# Altium schematic sheet LedsYOtros.SchDoc
size A4; DocumentNumber: 6; SheetNumber: 6; SheetTotal: 6
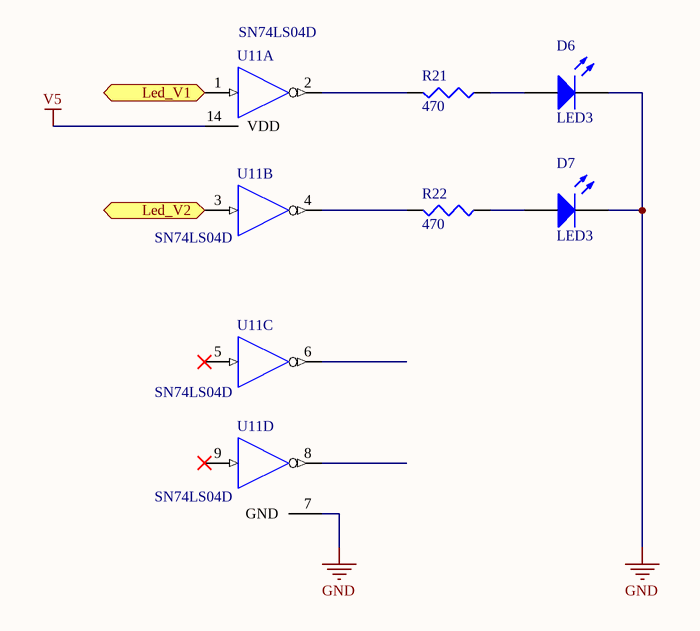
[diagram p0: LedsYOtros.SchDoc]

## Parts
D6  LED3  [*0603]
D7  LED3  [*0603]
R21  value 470  [Custom0805]  (hidden comment: Res3)
R22  value 470  [Custom0805]  (hidden comment: Res3)
U11  SN74LS04D  [751A-03_N]  (parts A,B,C,D of 6)

## Ports
Led_V1 (in), Led_V2 (in)

## Nets
GND: D6.2(K) D7.2(K) U11.7(GND)
V5: U11.14(VDD)
Led_V1: U11.1(IN) ; port Led_V1
Led_V2: U11.3(IN) ; port Led_V2
NetD6_1: D6.1(A) R21.1
NetD7_1: D7.1(A) R22.1
NetR21_2: R21.2 U11.2(~{OUT})
NetR22_2: R22.2 U11.4(~{OUT})

Not connected (* = marked no-connect by the designer): U11 5(IN)* 6(~{OUT}) 8(~{OUT}) 9(IN)*

## Library data of the parts
D6 D7 = LED3: Typical BLUE SiC LED; Published: 8-Jun-2000; LatestRevisionDate: 17-Dec-2003; LatestRevisionNote: PCB Footprint replaced.; DatasheetVersion: 16-Apr-2002; PackageVersion: 16-Apr-2002; PackageReference: 3.5X2.8X1.9; Publisher: Altium Limited; PackageDescription: SM LED; 2 C-Bend Leads; Body 3.5 x 2.8 x 1.9 mm, inc leads (LxWxH typ)
R21 R22 = Res3: Resistor; Published: 8-Jun-2000; LatestRevisionDate: 29-May-2009; LatestRevisionNote: IPC-7351 Footprint Added.; PackageReference: J1-0603; Publisher: Altium Limited; PackageDescription: Chip Resistor
U11 = SN74LS04D: Hex Inverter; Published: 15-Apr-2002; LatestRevisionDate: 13-Apr-2006; LatestRevisionNote: IPC-7351 Footprint Added.; DatasheetVersion: 1999; PackageReference: 751A-03; Publisher: Altium Limited; PackageDescription: 14-Pin Small Outline Integrated Circuit 1.27 mm Pitch; Code_JEDEC: MS-012-AB; Code_IPC: SOIC127P600-14; ComponentLink1Description: Manufacturer Link; ComponentLink1URL: http://www.onsemi.com/; ComponentLink2Description: Datasheet; ComponentLink2URL: http://www.onsemi.com/pub/Collateral/SN74LS04-D.PDF